# EAGLE design murdock_conn_v3 (EAGLE 6.4)
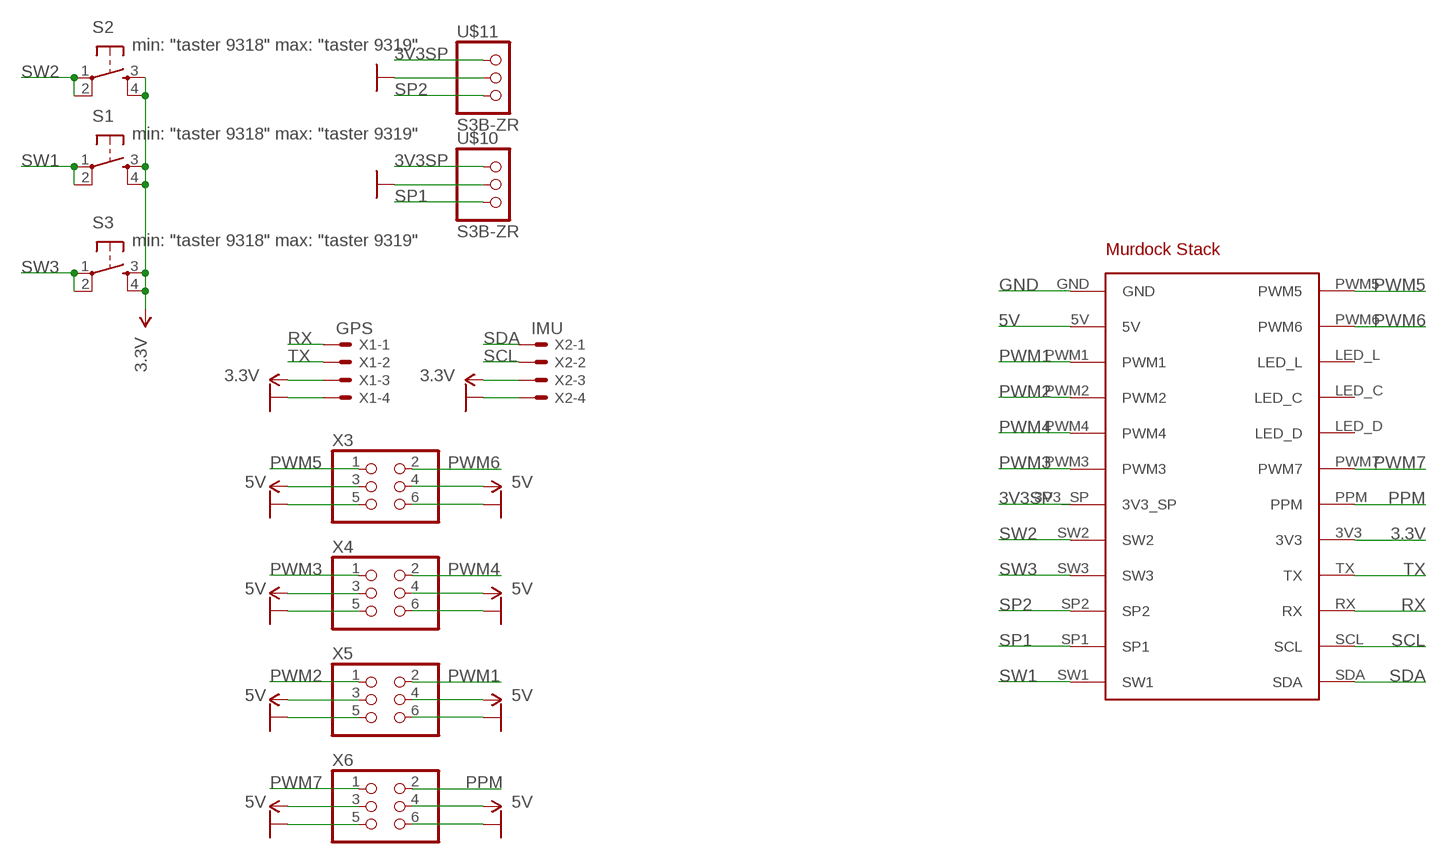
[diagram p0: schematic, sheet 1]

## Parts
S1  min: "taster 9318" max: "taster 9319"  LSH  [LSH]
S2  min: "taster 9318" max: "taster 9319"  LSH  [LSH]
S3  min: "taster 9318" max: "taster 9319"  LSH  [LSH]
U$10  S3B-ZR  [S3B-ZR]
U$11  S3B-ZR  [S3B-ZR]
X1  GPS  C-GRID-04-70553  [70553-04]
X2  IMU  C-GRID-04-70553  [70553-04]
X3  PINHD-2X3/90  [2X03/90]
X4  PINHD-2X3/90  [2X03/90]
X5  PINHD-2X3/90  [2X03/90]
X6  PINHD-2X3/90  [2X03/90]
X7  MURDOCK_STACK  [MURDOCK_STACK]

## Nets
3.3V: S1.3 S1.4 S2.3 S2.4 S3.3 S3.4 X1.3 X2.3 X7.3V3
3V3SP: U$10.1 U$11.1 X7.3V3_SP
5V: X3.3 X3.4 X4.3 X4.4 X5.3 X5.4 X6.3 X6.4 X7.5V
GND: U$10.2 U$11.2 X1.4 X2.4 X3.5 X3.6 X4.5 X4.6 X5.5 X5.6 X6.5 X6.6 X7.GND
PPM: X6.2 X7.PPM
PWM1: X5.2 X7.PWM1
PWM2: X5.1 X7.PWM2
PWM3: X4.1 X7.PWM3
PWM4: X4.2 X7.PWM4
PWM5: X3.1 X7.PWM5
PWM6: X3.2 X7.PWM6
PWM7: X6.1 X7.PWM7
RX: X1.1 X7.RX
SCL: X2.2 X7.SCL
SDA: X2.1 X7.SDA
SP1: U$10.3 X7.SP1
SP2: U$11.3 X7.SP2
SW1: S1.1 S1.2 X7.SW1
SW2: S2.1 S2.2 X7.SW2
SW3: S3.1 S3.2 X7.SW3
TX: X1.2 X7.TX
Unconnected: X7.LED_C X7.LED_D X7.LED_L

## Library data of the parts
S1-S3 = switch-tact:LSH
U$10 U$11 = seb:S3B-ZR
X1 X2 = con-molex:C-GRID-04: CONNECTOR wire to board 2.54 mm (0.100") pitch header; OC_FARNELL: unknown; OC_NEWARK: unknown
X3-X6 = pinhead:PINHD-2X3: PIN HEADER
X7 = murdock:MURDOCK_STACK

## Board
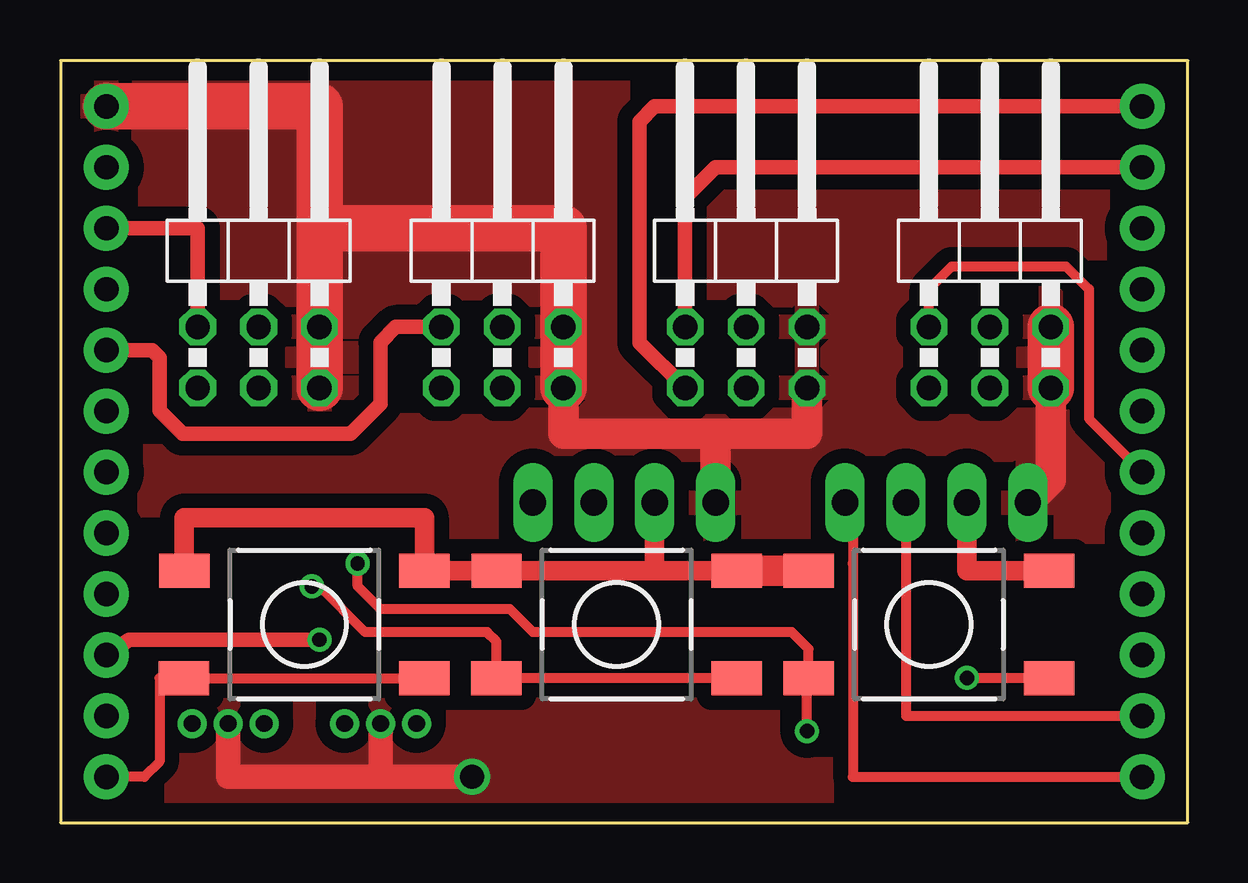
[diagram p1: board, top side]
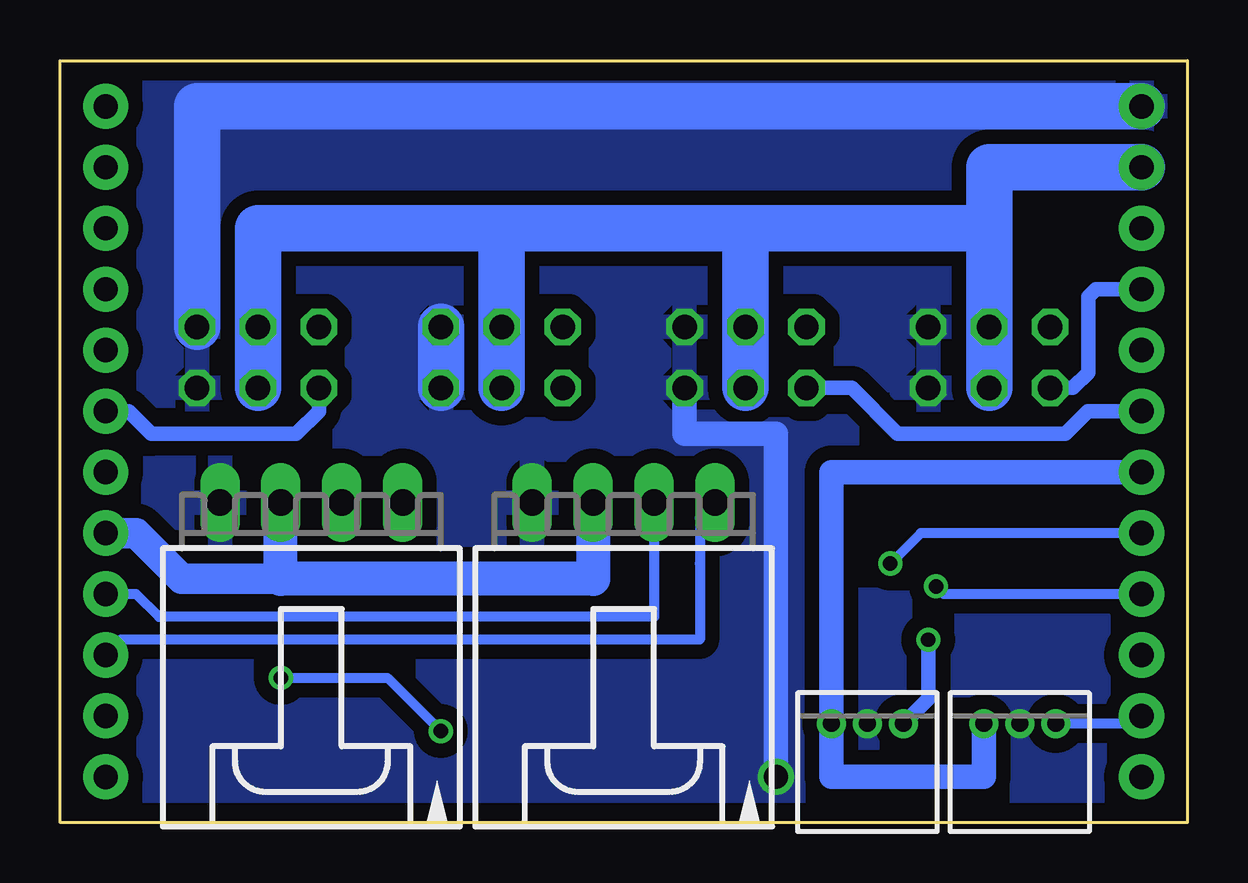
[diagram p2: board, bottom side, seen from below]

Size 46.99 x 31.75 mm. Coordinates in mm from the lower left corner, seen from the top.
Copper layers (1*16): Top 0.035mm / dielectric 1.5mm / Bottom 0.035mm
Design rules "default": minimum track width 10mil, minimum drill 0.4mm, track to track 8mil, track to pad 8mil, pad to pad 8mil, via to via 8mil, smd to smd 8mil, copper to edge 30mil, drill to drill 8mil, minimum pad ring 10mil, minimum via ring 8mil, stop-mask expansion 4mil, vias tented up to drill 1.5mm, thermal gap 10mil

### Footprints (pad centres in the part's own frame; a part is rotated, then mirrored left to right if it is on the bottom)
LSH = smd 2.1 x 1.4: 1 -5.005,2.24; 2 5.015,2.24; 3 -5.005,-2.24; 4 5.005,-2.24
S3B-ZR = drill 0.7 pad 1.1: 1 -1.5,0; 2 0,0; 3 1.5,0
70553-04 = drill 1.092 long: 1 -3.81,-7.62; 2 -1.27,-7.62; 3 1.27,-7.62; 4 3.81,-7.62
2X03/90 = drill 1.016 octagon: 1 -2.54,-6.35; 2 -2.54,-3.81; 3 0,-6.35; 4 0,-3.81; 5 2.54,-6.35; 6 2.54,-3.81
MURDOCK_STACK = drill 1.016 pad 1.88: 3V3 45.085,12.065; 3V3_SP 1.905,14.605; 5V 1.905,27.305; GND 1.905,29.845; LED_C 45.085,22.225; LED_D 45.085,19.685; LED_L 45.085,24.765; PPM 45.085,14.605; PWM1 1.905,24.765; PWM2 1.905,22.225; PWM3 1.905,17.145; PWM4 1.905,19.685; PWM5 45.085,29.845; PWM6 45.085,27.305; PWM7 45.085,17.145; RX 45.085,6.985; SCL 45.085,4.445; SDA 45.085,1.905; SP1 1.905,4.445; SP2 1.905,6.985; SW1 1.905,1.905; SW2 1.905,12.065; SW3 1.905,9.525; TX 45.085,9.525

### Placement (x,y rotation side)
S1  10.16,8.26 180 top
S2  36.2,8.26 180 top
S3  23.18,8.26 180 top
U$10  6.99,4.13 0 bottom
U$11  13.34,4.13 0 bottom
X1  23.5,5.71 180 bottom
X2  36.51,5.71 180 bottom
X3  28.57,24.46 0 top
X4  18.41,24.46 0 top
X5  8.26,24.46 0 top
X6  38.73,24.46 0 top
X7  0,0 0 top

### Tracks (layer width: path | path; a pad name or v marks a point on that pad's centre or on a via)
3.3V
  Top 0.813: S1.4 5.16,12.7 14.92,12.7 15.16,12.7 S1.3 S3.4 S3.3 24.77,10.49 X1.3 | S2.3 37.78,10.49 X2.3
  Top 1.27: S3.3 S2.4
  Bottom 1.27: 37.78,10.16 41.91,10.16 43.81,12.06 X7.3V3
  Bottom 1.422: X1.3 24.77,10.16 37.78,10.16 X2.3
3V3SP
  Bottom 1.016: U$10.1 8.48,1.91 8.57,1.91 14.84,1.91 U$11.1 14.84,14.61 X7.3V3_SP
5V
  Bottom 1.93: X5.3 X5.4 8.26,24.77 | 18.41,24.77 X4.4 X4.3 | 18.41,24.77 8.26,24.77 | 28.57,24.77 X3.4 X3.3 | 28.57,24.77 18.41,24.77 | 28.57,24.77 38.73,24.77 X6.4 X6.3 | X7.5V 8.26,27.3 8.26,24.77
GND  (via drill 1)
  Top 1.016: 13.34,1.91 v17.14,1.91 | 13.34,1.91 U$11.2 | 13.34,1.91 6.99,1.91 U$10.2
  Top 1.27: X1.4 27.3,16.19 | 27.3,16.19 20.95,16.19 X4.5 | X6.5 41.27,14.29 X2.4 | X3.5 31.11,16.19 27.3,16.19
  Top 1.93: 10.79,24.77 X5.6 X5.5 | 10.79,24.77 20.95,24.77 X4.6 X4.5 | X6.6 X6.5 | 10.79,24.77 10.79,29.84 X7.GND
  Bottom 1.016: v17.14,1.91 17.14,16.19 20.95,16.19 X4.5
  Bottom 1.93: X6.6 41.27,29.84 20.95,29.84 X7.GND | X3.6 X3.5
  pour Top (isolate 0.61): -0.64,32.38 -0.64,-0.64 47.31,-0.64 47.31,32.38
  pour Bottom (isolate 0.61): -0.64,32.38 -0.64,-0.64 47.31,-0.64 47.31,32.38
PPM
  Top 0.406: X6.2 36.2,22.23 37.15,23.18 41.91,23.18 42.86,22.23 42.86,16.83 X7.PPM
PWM1
  Top 0.61: X7.PWM1 5.71,24.77 X5.2
PWM2
  Bottom 0.61: X5.1 4.76,18.11 4.13,18.75 4.13,21.91 3.81,22.23 X7.PWM2
PWM3
  Bottom 0.61: X4.1 13.99,18.11 12.08,16.21 5.08,16.21 4.14,17.14 X7.PWM3
PWM4
  Top 0.61: X4.2 13.97,20.66 13.34,20.02 13.34,17.46 12.08,16.21 5.08,16.21 4.13,17.16 4.13,19.37 3.81,19.68 X7.PWM4
PWM5
  Top 0.61: X3.1 24.13,20 24.13,29.21 24.77,29.84 X7.PWM5
PWM6
  Top 0.61: X3.2 26.04,26.04 27.3,27.3 X7.PWM6
PWM7
  Bottom 0.61: X6.1 36.2,17.14 37.15,16.19 43.18,16.19 44.13,17.14 X7.PWM7
RX
  Bottom 0.406: X1.1 20.32,12.7 20.32,10.79 20.32,7.62 42.86,7.62 44.45,7.62 X7.RX
SCL
  Top 0.406: X2.2 35.24,4.45 X7.SCL
SDA
  Top 0.406: X2.1 33.02,13.02 33.02,10.79 33.02,1.91 X7.SDA
SP1
  Bottom 0.406: X7.SP1 2.22,4.13 U$10.3
SP2  (via drill 0.6)
  Top 0.61: v10.79,7.62 2.86,7.62 X7.SP2
  Bottom 0.61: v10.79,7.62 10.79,5.17 U$11.3
SW1
  Top 0.406: S1.1 S1.2 4.13,6.01 4.13,2.54 3.49,1.91 X7.SW1
SW2  (via drill 0.6)
  Top 0.406: v12.38,10.79 12.38,9.84 13.34,8.89 18.73,8.89 19.68,7.94 30.48,7.94 31.18,7.24 S2.2 31.11,5.95 v31.11,3.81 | S2.1 37.8,6.01 v37.78,6.03
  Bottom 0.406: v37.78,6.03 33.34,6.03 v31.11,3.81 | X7.SW2 11.11,12.06 v12.38,10.79
SW3  (via drill 0.6)
  Top 0.406: S3.1 S3.2 18.16,7.55 17.78,7.94 12.7,7.94 10.79,9.84 v10.48,9.84
  Bottom 0.406: X7.SW3 10.16,9.53 v10.48,9.84
TX
  Bottom 0.406: X1.2 22.23,8.57 42.86,8.57 43.81,9.53 X7.TX